# Altium schematic sheet f429ig.schdoc
size 431 x 309 mm; Symbol: Sheet-Symbol_A3; Device: Sheet-Symbol_A3; @Page Name: P1; @Create Date: 2023-08-19; @Page Count: 1; @Page No: 1; @Project Name: STM32F429IGT6_Moriarty; @Schematic Name: Schematic1_1; @Update Date: 2023-09-02; Company: 嘉立创EDA; Page Size: A3; Version: V1.0
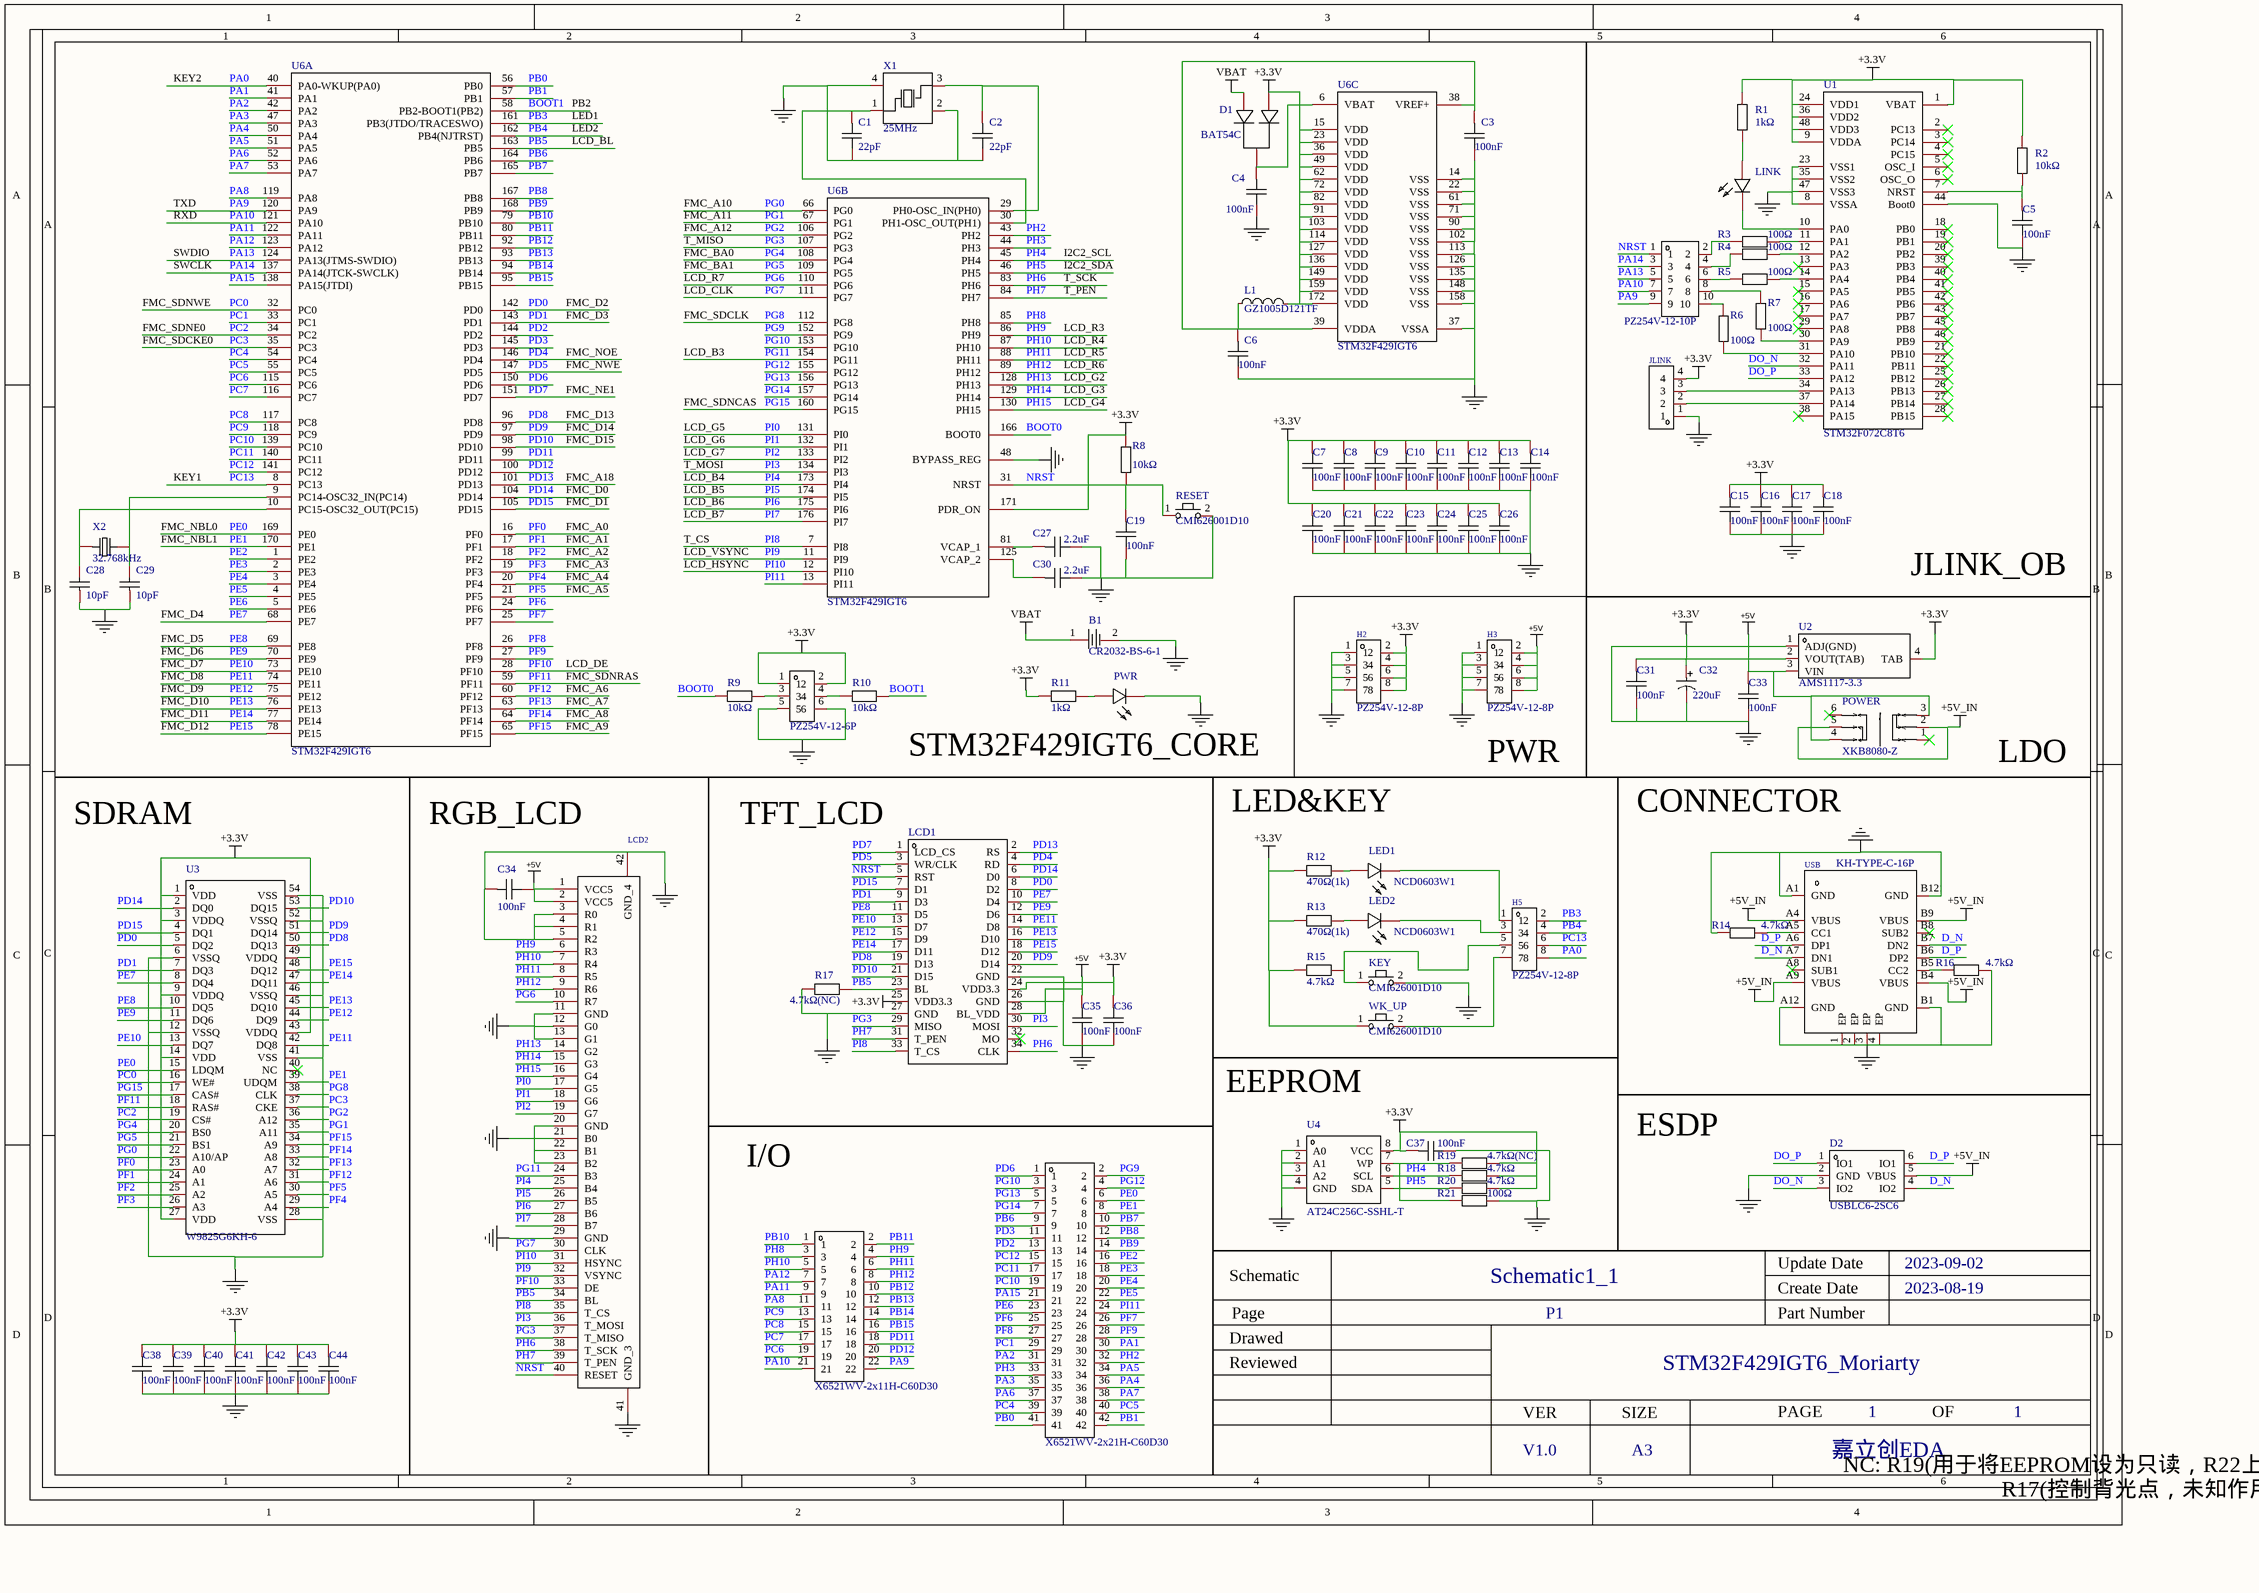
[diagram p0: f429ig.schdoc]

## Parts
B1  CR2032-BS-6-1  [BAT-TH_CR2032-BS-6-1]
C1  22pF  [C0603]
C2  22pF  [C0603]
C3  100nF  [C0603]
C4  100nF  [C0603]
C5  100nF  [C0603]
C6  100nF  [C0603]
C7  100nF  [C0603]
C8  100nF  [C0603]
C9  100nF  [C0603]
C10  100nF  [C0603]
C11  100nF  [C0603]
C12  100nF  [C0603]
C13  100nF  [C0603]
C14  100nF  [C0603]
C15  100nF  [C0603]
C16  100nF  [C0603]
C17  100nF  [C0603]
C18  100nF  [C0603]
C19  100nF  [C0603]
C20  100nF  [C0603]
C21  100nF  [C0603]
C22  100nF  [C0603]
C23  100nF  [C0603]
C24  100nF  [C0603]
C25  100nF  [C0603]
C26  100nF  [C0603]
C27  2.2uF  [C0603]
C28  10pF  [C0603]
C29  10pF  [C0603]
C30  2.2uF  [C0603]
C31  100nF  [C0603]
C32  220uF  [CAP-SMD_BD6.3-L6.6-W6.6-FD]
C33  100nF  [C0603]
C34  100nF  [C0603]
C35  100nF  [C0603]
C36  100nF  [C0603]
C37  100nF  [C0603]
C38  100nF  [C0603]
C39  100nF  [C0603]
C40  100nF  [C0603]
C41  100nF  [C0603]
C42  100nF  [C0603]
C43  100nF  [C0603]
C44  100nF  [C0603]
D1  BAT54C  [SOT-23-3_L2.9-W1.6-P1.90-LS2.8-BR]
D2  USBLC6-2SC6  [SOT-23-6_L2.9-W1.6-P0.95-LS2.8-BL]
H1  PZ254V-12-10P  [HDR-TH_10P-P2.54-V-M-R2-C5-S2.54]
H2  PZ254V-12-8P  [HDR-TH_8P-P2.54-V-M-R2-C4-S2.54]
H3  PZ254V-12-8P  [HDR-TH_8P-P2.54-V-M-R2-C4-S2.54]
H4  PZ254V-12-6P  [HDR-TH_6P-P2.54-V-M-R2-C3-S2.54]
H5  PZ254V-12-8P  [HDR-TH_8P-P2.54-V-M-R2-C4-S2.54]
H6  X6521WV-2x11H-C60D30  [HDR-TH_22P-2.54-V-M-R2-C11-S2.54]
JLINK  PZ254V-11-04P  [HDR-TH_4P-P2.54-V-M]  (value not drawn)
KEY  CMI626001D10  [SW-TH_2P-L6.2-W6.2-P5.0]
L1  GZ1005D121TF  [L0402]
LCD1  (no value)  [HDR-TH_34P-P2.54-V-F-R2-C17-S2.54]
LCD2  (no value)  [FPC-SMD_P0.50-40P_FGS-XJ-H2.0]
LED1  NCD0603W1  [LED0603-RD]
LED2  NCD0603W1  [LED0603-RD]
LINK  NCD0603W1  [LED0603-RD]  (value not drawn)
POWER  XKB8080-Z  [SW-TH_6P-L8.0-W8.0-P2.50]
PWR  NCD0603W1  [LED0603-RD]  (value not drawn)
R1  1kΩ  [R0603]
R2  10kΩ  [R0603]
R3  100Ω  [R0603]
R4  100Ω  [R0603]
R5  100Ω  [R0603]
R6  100Ω  [R0603]
R7  100Ω  [R0603]
R8  10kΩ  [R0603]
R9  10kΩ  [R0603]
R10  10kΩ  [R0603]
R11  1kΩ  [R0603]
R12  470Ω(1k)  [R0603]
R13  470Ω(1k)  [R0603]
R14  4.7kΩ  [R0603]
R15  4.7kΩ  [R0603]
R16  4.7kΩ  [R0603]
R17  4.7kΩ(NC)  [R0603]
R18  4.7kΩ  [R0603]
R19  4.7kΩ(NC)  [R0603]
R20  4.7kΩ  [R0603]
R21  100Ω  [R0603]
RESET  CMI626001D10  [SW-TH_2P-L6.2-W6.2-P5.0]
U1  STM32F072C8T6  [LQFP-48_L7.0-W7.0-P0.50-LS9.0-BL]
U2  AMS1117-3.3  [SOT-223-4_L6.5-W3.5-P2.30-LS7.0-BR]
U3  W9825G6KH-6  [TSOP-54_L22.2-W10.2-P0.80-LS11.8-BL]
U4  AT24C256C-SSHL-T  [SOIC-8_L4.9-W3.9-P1.27-LS6.0-BL]
U5  X6521WV-2x21H-C60D30  [HDR-TH_42P-P2.54-V-M-R2-C21-S2.54]
U6  STM32F429IGT6  [LQFP-176_L24.0-W24.0-P0.50-LS26.0-BL]  (parts A,B,C of 3)
USB  KH-TYPE-C-16P  [USB-C-SMD_KH-TYPE-C-16P]
WK_UP  CMI626001D10  [SW-TH_2P-L6.2-W6.2-P5.0]
X1  25MHz  [OSC-SMD_4P-L3.2-W2.5-BL]
X2  32.768kHz  [CRYSTAL-SMD_L3.2-W1.5-1]

## Blocks framed on the sheet
STM32F429IGT6_CORE: B1 C1-C4 C6-C14 C19-C30 D1 H4 L1 PWR R8-R11 RESET U6 X1 X2
JLINK_OB: C5 C15-C18 H1 JLINK LINK R1-R7 U1
PWR: H2 H3
SDRAM: C38-C44 U3
RGB_LCD: C34 LCD2
LED&KEY: H5 KEY LED1 LED2 R12 R13 R15 WK_UP
EEPROM: C37 R18-R21 U4
ESDP: D2
I/O: H6 U5

## Nets
+3.3V: C7.2 C8.2 C9.2 C10.2 C11.2 C12.2 C13.2 C14.2 C15.2 C16.2 C17.2 C18.2 C20.2 C21.2 C22.2 C23.2 C24.2 C25.2 C26.2 C31.2 C32.1 C36.2 C37.2 C38.2 C39.2 C40.2 C41.2 C42.2 C43.2 C44.2 D1.1(A1) H2.2 H2.4 H2.6 H2.8 H4.1 H4.2 JLINK.4 L1.2 LCD1.24(VDD3.3) LCD1.25(VDD3.3) R1.2 R2.2 R8.2 R11.2 R12.1 R13.1 R15.2 R18.1 R19.1 R20.1 U1.1(VBAT) U1.9(VDDA) U1.24(VDD1) U1.36(VDD2) U1.48(VDD3) U2.2(VOUT(TAB)) U2.4(TAB) U3.1(VDD) U3.3(VDDQ) U3.9(VDDQ) U3.14(VDD) U3.27(VDD) U3.43(VDDQ) U3.49(VDDQ) U4.8(VCC) U6.15(VDD) U6.23(VDD) U6.36(VDD) U6.49(VDD) U6.62(VDD) U6.72(VDD) U6.82(VDD) U6.91(VDD) U6.103(VDD) U6.114(VDD) U6.127(VDD) U6.136(VDD) U6.149(VDD) U6.159(VDD) U6.171(PDR_ON) U6.172(VDD) WK_UP.1
+5V: C33.2 C34.1 C35.2 H3.2 H3.4 H3.6 H3.8 LCD1.28(BL_VDD) LCD2.1(VCC5) LCD2.2(VCC5) POWER.3 POWER.4 U2.3(VIN)
+5V_IN: D2.5(VBUS) POWER.2 POWER.5 USB.A4(VBUS) USB.A9(VBUS) USB.B4(VBUS) USB.B9(VBUS)
NetB1_2: B1.2 C1.1 C2.1 C3.1 C4.1 C5.1 C6.1 C7.1 C8.1 C9.1 C10.1 C11.1 C12.1 C13.1 C14.1 C15.1 C16.1 C17.1 C18.1 C19.1 C20.1 C21.1 C22.1 C23.1 C24.1 C25.1 C26.1 C27.1 C28.1 C29.1 C30.1 C31.1 C32.2 C33.1 C34.2 C35.1 C36.1 C37.1 C38.1 C39.1 C40.1 C41.1 C42.1 C43.1 C44.1 D2.2(GND) H2.1 H2.3 H2.5 H2.7 H3.1 H3.3 H3.5 H3.7 H4.5 H4.6 JLINK.1 KEY.2 LCD1.22(GND) LCD1.26(GND) LCD1.27(GND) LCD2.3(R0) LCD2.4(R1) LCD2.5(R2) LCD2.11(GND) LCD2.12(G0) LCD2.13(G1) LCD2.20(GND) LCD2.21(B0) LCD2.22(B1) LCD2.23(B2) LCD2.29(GND) LCD2.41(GND_3) LCD2.42(GND_4) PWR.1(-) R14.2 R16.1 R17.2 R21.1 RESET.2 U1.8(VSSA) U1.23(VSS1) U1.35(VSS2) U1.44(Boot0) U1.47(VSS3) U2.1(ADJ(GND)) U3.6(VSSQ) U3.12(VSSQ) U3.28(VSS) U3.41(VSS) U3.46(VSSQ) U3.52(VSSQ) U3.54(VSS) U4.1(A0) U4.2(A1) U4.3(A2) U4.4(GND) U6.14(VSS) U6.22(VSS) U6.37(VSSA) U6.48(BYPASS_REG) U6.61(VSS) U6.71(VSS) U6.90(VSS) U6.102(VSS) U6.113(VSS) U6.126(VSS) U6.135(VSS) U6.148(VSS) U6.158(VSS) USB.1(EP) USB.2(EP) USB.3(EP) USB.4(EP) USB.A1(GND) USB.A12(GND) USB.B1(GND) USB.B12(GND) X1.2(GND) X1.4(GND)
VBAT: B1.1 D1.2(A2)
BOOT0: R9.2 U6.166(BOOT0)
BOOT1: R10.1 U6.58(PB2-BOOT1(PB2))
D_N: D2.4(IO2) USB.A7(DN1) USB.B7(DN2)
D_P: D2.6(IO1) USB.A6(DP1) USB.B6(DP2)
DO_N: D2.3(IO2) U1.32(PA11)
DO_P: D2.1(IO1) U1.33(PA12)
NRST: C19.2 H1.1 LCD1.5(RST) LCD2.40(RESET) R8.1 RESET.1 U6.31(NRST)
PA0: H5.8 U6.40(PA0-WKUP(PA0))
PA1: U5.30 U6.41(PA1)
PA2: U5.31 U6.42(PA2)
PA3: U5.35 U6.47(PA3)
PA4: U5.36 U6.50(PA4)
PA5: U5.34 U6.51(PA5)
PA6: U5.37 U6.52(PA6)
PA7: U5.38 U6.53(PA7)
PA8: H6.11 U6.119(PA8)
PA9: H1.9 H6.22 U6.120(PA9)
PA10: H1.7 H6.21 U6.121(PA10)
PA11: H6.9 U6.122(PA11)
PA12: H6.7 U6.123(PA12)
PA13: H1.5 U6.124(PA13(JTMS-SWDIO))
PA14: H1.3 U6.137(PA14(JTCK-SWCLK))
PA15: U5.21 U6.138(PA15(JTDI))
PB0: U5.41 U6.56(PB0)
PB1: U5.42 U6.57(PB1)
PB3: H5.2 U6.161(PB3(JTDO/TRACESWO))
PB4: H5.4 U6.162(PB4(NJTRST))
PB5: LCD1.23(BL) LCD2.34(BL) R17.1 U6.163(PB5)
PB6: U5.9 U6.164(PB6)
PB7: U5.10 U6.165(PB7)
PB8: U5.12 U6.167(PB8)
PB9: U5.14 U6.168(PB9)
PB10: H6.1 U6.79(PB10)
PB11: H6.2 U6.80(PB11)
PB12: H6.10 U6.92(PB12)
PB13: H6.12 U6.93(PB13)
PB14: H6.14 U6.94(PB14)
PB15: H6.16 U6.95(PB15)
PC0: U3.16(WE#) U6.32(PC0)
PC1: U5.29 U6.33(PC1)
PC2: U3.19(CS#) U6.34(PC2)
PC3: U3.37(CKE) U6.35(PC3)
PC4: U5.39 U6.54(PC4)
PC5: U5.40 U6.55(PC5)
PC6: H6.19 U6.115(PC6)
PC7: H6.17 U6.116(PC7)
PC8: H6.15 U6.117(PC8)
PC9: H6.13 U6.118(PC9)
PC10: U5.19 U6.139(PC10)
PC11: U5.17 U6.140(PC11)
PC12: U5.15 U6.141(PC12)
PC13: H5.6 U6.8(PC13)
PD0: LCD1.8(D2) U3.5(DQ2) U6.142(PD0)
PD1: LCD1.9(D3) U3.7(DQ3) U6.143(PD1)
PD2: U5.13 U6.144(PD2)
PD3: U5.11 U6.145(PD3)
PD4: LCD1.4(RD) U6.146(PD4)
PD5: LCD1.3(WR/CLK) U6.147(PD5)
PD6: U5.1 U6.150(PD6)
PD7: LCD1.1(LCD_CS) U6.151(PD7)
PD8: LCD1.19(D13) U3.50(DQ13) U6.96(PD8)
PD9: LCD1.20(D14) U3.51(DQ14) U6.97(PD9)
PD10: LCD1.21(D15) U3.53(DQ15) U6.98(PD10)
PD11: H6.18 U6.99(PD11)
PD12: H6.20 U6.100(PD12)
PD13: LCD1.2(RS) U6.101(PD13)
PD14: LCD1.6(D0) U3.2(DQ0) U6.104(PD14)
PD15: LCD1.7(D1) U3.4(DQ1) U6.105(PD15)
PE0: U3.15(LDQM) U5.6 U6.169(PE0)
PE1: U3.39(UDQM) U5.8 U6.170(PE1)
PE2: U5.16 U6.1(PE2)
PE3: U5.18 U6.2(PE3)
PE4: U5.20 U6.3(PE4)
PE5: U5.22 U6.4(PE5)
PE6: U5.23 U6.5(PE6)
PE7: LCD1.10(D4) U3.8(DQ4) U6.68(PE7)
PE8: LCD1.11(D5) U3.10(DQ5) U6.69(PE8)
PE9: LCD1.12(D6) U3.11(DQ6) U6.70(PE9)
PE10: LCD1.13(D7) U3.13(DQ7) U6.73(PE10)
PE11: LCD1.14(D8) U3.42(DQ8) U6.74(PE11)
PE12: LCD1.15(D9) U3.44(DQ9) U6.75(PE12)
PE13: LCD1.16(D10) U3.45(DQ10) U6.76(PE13)
PE14: LCD1.17(D11) U3.47(DQ11) U6.77(PE14)
PE15: LCD1.18(D12) U3.48(DQ12) U6.78(PE15)
PF0: U3.23(A0) U6.16(PF0)
PF1: U3.24(A1) U6.17(PF1)
PF2: U3.25(A2) U6.18(PF2)
PF3: U3.26(A3) U6.19(PF3)
PF4: U3.29(A4) U6.20(PF4)
PF5: U3.30(A5) U6.21(PF5)
PF6: U5.25 U6.24(PF6)
PF7: U5.26 U6.25(PF7)
PF8: U5.27 U6.26(PF8)
PF9: U5.28 U6.27(PF9)
PF10: LCD2.33(DE) U6.28(PF10)
PF11: U3.18(RAS#) U6.59(PF11)
PF12: U3.31(A6) U6.60(PF12)
PF13: U3.32(A7) U6.63(PF13)
PF14: U3.33(A8) U6.64(PF14)
PF15: U3.34(A9) U6.65(PF15)
PG0: U3.22(A10/AP) U6.66(PG0)
PG1: U3.35(A11) U6.67(PG1)
PG2: U3.36(A12) U6.106(PG2)
PG3: LCD1.29(MISO) LCD2.37(T_MISO) U6.107(PG3)
PG4: U3.20(BS0) U6.108(PG4)
PG5: U3.21(BS1) U6.109(PG5)
PG6: LCD2.10(R7) U6.110(PG6)
PG7: LCD2.30(CLK) U6.111(PG7)
PG8: U3.38(CLK) U6.112(PG8)
PG9: U5.2 U6.152(PG9)
PG10: U5.3 U6.153(PG10)
PG11: LCD2.24(B3) U6.154(PG11)
PG12: U5.4 U6.155(PG12)
PG13: U5.5 U6.156(PG13)
PG14: U5.7 U6.157(PG14)
PG15: U3.17(CAS#) U6.160(PG15)
PH2: U5.32 U6.43(PH2)
PH3: U5.33 U6.44(PH3)
PH4: R18.2 U4.6(SCL) U6.45(PH4)
PH5: R20.2 U4.5(SDA) U6.46(PH5)
PH6: LCD1.34(CLK) LCD2.38(T_SCK) U6.83(PH6)
PH7: LCD1.31(T_PEN) LCD2.39(T_PEN) U6.84(PH7)
PH8: H6.3 U6.85(PH8)
PH9: H6.4 LCD2.6(R3) U6.86(PH9)
PH10: H6.5 LCD2.7(R4) U6.87(PH10)
PH11: H6.6 LCD2.8(R5) U6.88(PH11)
PH12: H6.8 LCD2.9(R6) U6.89(PH12)
PH13: LCD2.14(G2) U6.128(PH13)
PH14: LCD2.15(G3) U6.129(PH14)
PH15: LCD2.16(G4) U6.130(PH15)
PI0: LCD2.17(G5) U6.131(PI0)
PI1: LCD2.18(G6) U6.132(PI1)
PI2: LCD2.19(G7) U6.133(PI2)
PI3: LCD1.30(MOSI) LCD2.36(T_MOSI) U6.134(PI3)
PI4: LCD2.25(B4) U6.173(PI4)
PI5: LCD2.26(B5) U6.174(PI5)
PI6: LCD2.27(B6) U6.175(PI6)
PI7: LCD2.28(B7) U6.176(PI7)
PI8: LCD1.33(T_CS) LCD2.35(T_CS) U6.7(PI8)
PI9: LCD2.32(VSYNC) U6.11(PI9)
PI10: LCD2.31(HSYNC) U6.12(PI10)
PI11: U5.24 U6.13(PI11)
NetC1_2: C1.2 U6.30(PH1-OSC_OUT(PH1)) X1.1(OSC1)
NetC2_2: C2.2 U6.29(PH0-OSC_IN(PH0)) X1.3(OSC2)
NetC3_2: C3.2 C6.2 L1.1 U6.38(VREF+) U6.39(VDDA)
NetC4_2: C4.2 D1.3(K) U6.6(VBAT)
NetC5_2: C5.2 R2.1 U1.7(NRST)
NetC27_2: C27.2 U6.81(VCAP_1)
NetC28_2: C28.2 U6.10(PC15-OSC32_OUT(PC15)) X2.1
NetC29_2: C29.2 U6.9(PC14-OSC32_IN(PC14)) X2.2
NetC30_2: C30.2 U6.125(VCAP_2)
NetH1_2: H1.2 R3.2
NetH1_4: H1.4 R4.2
NetH1_6: H1.6 R5.2
NetH1_8: H1.8 R7.1
NetH1_10: H1.10 R6.1
NetH4_3: H4.3 R9.1
NetH4_4: H4.4 R10.2
NetH5_1: H5.1 LED1.1(-)
NetH5_3: H5.3 LED2.1(-)
NetH5_5: H5.5 KEY.1 R15.1
NetH5_7: H5.7 WK_UP.2
NetJLINK_2: JLINK.2 U1.37(PA14)
NetJLINK_3: JLINK.3 U1.34(PA13)
NetLED1_2: LED1.2(+) R12.2
NetLED2_2: LED2.2(+) R13.2
NetLINK_1: LINK.1(-) U1.10(PA0)
NetLINK_2: LINK.2(+) R1.1
NetPWR_2: PWR.2(+) R11.1
NetR3_1: R3.1 U1.11(PA1)
NetR4_1: R4.1 U1.12(PA2)
NetR5_1: R5.1 U1.14(PA4)
NetR6_2: R6.2 U1.31(PA10)
NetR7_2: R7.2 U1.30(PA9)
NetR14_1: R14.1 USB.A5(CC1)
NetR16_2: R16.2 USB.B5(CC2)
NetR19_2: R19.2 R21.2 U4.7(WP)

Not connected (* = marked no-connect by the designer): LCD1 32(MO)*; POWER 1* 6*; U1 2(PC13)* 3(PC14)* 4(PC15)* 5(OSC_I)* 6(OSC_O)* 13(PA3)* 15(PA5)* 16(PA6)* 17(PA7)* 18(PB0)* 19(PB1)* 20(PB2)* 21(PB10)* 22(PB11)* 25(PB12)* 26(PB13)* 27(PB14)* 28(PB15)* 29(PA8)* 38(PA15)* 39(PB3)* 40(PB4)* 41(PB5)* 42(PB6)* 43(PB7)* 45(PB8)* 46(PB9)*; U3 40(NC)*; USB A8(SUB1)* B8(SUB2)*

## Notes on the sheet
- KEY2
- PB2
- LED1
- LED2
- LCD_BL
- TXD
- RXD
- FMC_A10
- FMC_A11
- FMC_A12
- FMC_SDNWE
- SWDIO
- SWCLK
- FMC_D2
- FMC_BA0
- FMC_BA1
- LCD_R7
- LCD_CLK
- T_MISO
- T_SCK
- T_PEN
- I2C2_SCL
- I2C2_SDA
- FMC_SDNE0
- FMC_SDCKE0
- FMC_D3
- FMC_NOE
- FMC_SDCLK
- LCD_B3
- LCD_R3
- LCD_R4
- LCD_R5
- FMC_D13
- FMC_D14
- FMC_NE1
- FMC_NWE
- FMC_SDNCAS
- LCD_G5
- LCD_G2
- (near R8) LCD_G4
- LCD_R6
- LCD_G3
- KEY1
- FMC_D15
- FMC_A18
- LCD_G7
- LCD_B4
- LCD_G6
- T_MOSI
- FMC_NBL0
- FMC_NBL1
- FMC_D0
- FMC_D1
- FMC_A0
- FMC_A1
- FMC_A2
- LCD_VSYNC
- LCD_B5
- LCD_B6
- LCD_B7
- T_CS
- FMC_A3
- FMC_A4
- FMC_A5
- LCD_HSYNC
- (near C29) FMC_D4
- FMC_D5
- FMC_D6
- FMC_D7
- FMC_D8
- FMC_SDNRAS
- LCD_DE
- FMC_D9
- FMC_D10
- FMC_D11
- FMC_D12
- FMC_A6
- FMC_A7
- FMC_A8
- FMC_A9
- LDO
- TFT_LCD
- CONNECTOR
- NC: R19(用于将EEPROM设为只读，R22上件，R23不上件时为只读)
  R17(控制背光点，未知作用，暂时不接)
- 1
- 2
- 3
- 4
- 5
- 6
- A
- B
- C
- Schematic
- Schematic1_1
- Create Date
- Update Date
- 2023-08-19
- 2023-09-02
- D
- Reviewed
- Drawed
- Page
- P1
- Part Number
- STM32F429IGT6_Moriarty
- VER
- SIZE
- PAGE
- OF
- V1.0
- A3
- 嘉立创EDA

## Library data of the parts
B1 = CR2032-BS-6-1: 连接器类型:电池底座;适用电池规格:CR2032;工作温度范围:-;; Manufacturer: QJ; Add into BOM: yes; Connector Type: 电池底座; Battery Type: CR2032; Name: CR2032-BS-6-1; Symbol: CR2032-BS-6-1; Device: CR2032-BS-6-1; LCSC Part Name: 电池底座 适用电池:CR2032; Supplier Part: C70377; Manufacturer Part: CR2032-BS-6-1; Supplier Footprint: SMD; JLCPCB Part Class: 扩展库; Datasheet: https://atta.szlcsc.com/upload/public/pdf/source/20160427/1461725216549.pdf; Supplier: LCSC; Convert to PCB: yes; Operating Temperature Range: -
C1 C2 = 0603CG220J500NT: 温度系数:C0G;精度:±5%;额定电压:50V;容值:22pF;; Manufacturer: FH(风华); Add into BOM: yes; Temperature Coefficient: C0G; Tolerance: ±5%; Voltage Rated: 50V; Name: 22pF; Symbol: 0603CG220J500NT; Device: 0603CG220J500NT; LCSC Part Name: 22pF(220) ±5% 50V; Supplier Part: C91701; Manufacturer Part: 0603CG220J500NT; Supplier Footprint: 0603; JLCPCB Part Class: Extended Part; Datasheet: https://atta.szlcsc.com/upload/public/pdf/source/20170923/C91701_1506149567492988977.pdf; Supplier: LCSC; Convert to PCB: yes; Value: 22pF
C3 C6 = CAP_0603: Symbol: CapAcitance; Convert to PCB: yes; Name: 100nF; Device: CAP_0603; Add into BOM: yes; Supplier Footprint: 0603; Value: 100nF
C4 C5 C7-C26 C31 C33-C44 = CC0603KRX7R9BB104: 容值:100nF;精度:±10%;额定电压:50V;材质(温度系数):X7R;; Manufacturer: YAGEO(国巨); Add into BOM: yes; Tolerance: ±10%; Voltage Rated: 50V; Temperature Coefficient: X7R; Name: 100nF; Symbol: CC0603KRX7R9BB104; Device: CC0603KRX7R9BB104; LCSC Part Name: 100nF ±10% 50V; Supplier Part: C14663; Manufacturer Part: CC0603KRX7R9BB104; Supplier Footprint: 0603; JLCPCB Part Class: Basic Part; Datasheet: https://atta.szlcsc.com/upload/public/pdf/source/20180910/C282072_33301C7F631E79921B82A8DAC6BCC5B3.pdf; Supplier: LCSC; Convert to PCB: yes; Value: 100nF
C27 C30 = CL10A225KQ8NNNC: 容值:2.2uF;精度:±10%;额定电压:6.3V;材质(温度系数):X5R;; Manufacturer: SAMSUNG(三星); Add into BOM: yes; Tolerance: ±10%; Voltage Rated: 6.3V; Temperature Coefficient: X5R; Name: 2.2uF; Symbol: CL10A225KQ8NNNC; Device: CL10A225KQ8NNNC; LCSC Part Name: 2.2uF ±10% 6.3V; Supplier Part: C71000; Manufacturer Part: CL10A225KQ8NNNC; Supplier Footprint: 0603; JLCPCB Part Class: Extended Part; Datasheet: https://atta.szlcsc.com/upload/public/pdf/source/20180326/C71000_DC8419B77556AD3ECA55C764A060977E.pdf; Supplier: LCSC; Convert to PCB: yes; Value: 2.2uF
C28 C29 = CC0603JRNPO9BN100: 容值:10pF;精度:±5%;额定电压:50V;材质(温度系数):NP0;; Manufacturer: YAGEO(国巨); Add into BOM: yes; Tolerance: ±5%; Voltage Rated: 50V; Temperature Coefficient: NP0; Name: 10pF; Symbol: CC0603JRNPO9BN100; Device: CC0603JRNPO9BN100; LCSC Part Name: 10pF ±5% 50V; Supplier Part: C106245; Manufacturer Part: CC0603JRNPO9BN100; Supplier Footprint: 0603; JLCPCB Part Class: 扩展库; Datasheet: https://atta.szlcsc.com/upload/public/pdf/source/20170505/1493957837406.pdf; Supplier: LCSC; Convert to PCB: yes; Value: 10pF
C32 = RVT1A221M0605_C72494: 容值:220uF;精度:±20%;额定电压:10V;纹波电流:-;等效串联电阻:-;; Manufacturer: ROQANG(容强); Symbol: RVT1A221M0605-C72494; Add into BOM: yes; Tolerance: ±20%; Rated Voltage: 10V; φD: 6.3mm; L: 5.4mm; Lifetime @ Temp: 2000hrs@105℃; Name: 220uF; Device: RVT1A221M0605_C72494; LCSC Part Name: 220uF ±20% 10V; Supplier Part: C72494; Manufacturer Part: RVT1A221M0605; Supplier Footprint: SMD,D6.3xL5.4mm; JLCPCB Part Class: 扩展库; Datasheet: https://atta.szlcsc.com/upload/public/pdf/source/20170217/1487312287485.pdf; Supplier: LCSC; Convert to PCB: yes; Value: 220uF; Ripple Current: -; Equivalent Series Resistance(ESR): -; Operating Temperature: -45℃~+105℃
D1 = BAT54C_C2135: 二极管配置:-;直流反向耐压(Vr):30V;平均整流电流(Io):200mA;正向压降(Vf):1V@100mA;; Manufacturer: CJ(江苏长电/长晶); Add into BOM: yes; Reverse Voltage (Vr): 30V; Average Rectified Current (Io): 200mA; Name: BAT54C; Symbol: BAT54C; Device: BAT54C_C2135; LCSC Part Name: 30V 200mA 1V@100mA; Supplier Part: C2135; Manufacturer Part: BAT54C; Supplier Footprint: SOT-23; JLCPCB Part Class: 扩展库; Datasheet: https://atta.szlcsc.com/upload/public/pdf/source/20140809/1457707208935.pdf; Supplier: LCSC; Convert to PCB: yes; Diode Configuration: -; Forward Voltage (Vf@If): 1V@100mA; Reverse Leakage Current (Ir): -
D2 = USBLC6-2SC6_C2827654: USBLC6-2SC6 Vrwm:5V 印记：UL26  ESD静电管静电放电(ESD)保护器件; Manufacturer: TECH PUBLIC(台舟); Add into BOM: yes; Name: USBLC6-2SC6; Symbol: USBLC6-2SC6_C2827654; Device: USBLC6-2SC6_C2827654; LCSC Part Name: USBLC6-2SC6; Supplier Part: C2827654; Manufacturer Part: USBLC6-2SC6; Supplier Footprint: SOT-23-6; JLCPCB Part Class: Extended Part; Datasheet: https://atta.szlcsc.com/upload/public/pdf/source/20210810/FBD75DE717D6D97BAC6DD7F2B5C09DCD.pdf; Supplier: LCSC; Convert to PCB: yes
H1 = PZ254V-12-10P: 排数:双排;总PIN位数:10;间距:2.54mm;插针结构:2x5P;行距:2.54mm;安装类型:直插;圆针/方针:方针;额定电流:-;额定电压:-;配合针长度:6mm;塑高:2.5mm;端接针长度:3mm;触头材质:黄铜;触头镀层:-;工作温度范围:-40℃~+105℃;颜色:黑色;; Manufacturer: XFCN(兴飞); Add into BOM: yes; Pitch: 2.54mm; Pin Structure: 2x5P; Circluar Pins/Square Pins: 方针; Name: PZ254V-12-10P; Symbol: PZ254V-12-10P; Device: PZ254V-12-10P; LCSC Part Name: 2.54mm 2x5P 直插 方针; Supplier Part: C492422; Manufacturer Part: PZ254V-12-10P; Supplier Footprint: 直插,P=2.54mm; JLCPCB Part Class: 扩展库; Supplier: LCSC; Convert to PCB: yes; Number of Rows: 双排; Number of Pins: 10; Row Spacing: 2.54mm; Mounting Type: 直插; Current Rating (Max): -; Voltage Rating (Max): -; Length of Mating Pin: 6mm; Insulation Height: 2.5mm; Length of End Connection Pin: 3mm; Contact Material: 黄铜; Contact Plating: -; Operating Temperature Range: -40℃~+105℃; Color: 黑色
H2 H3 H5 = PZ254V-12-8P: 排数:双排;总PIN位数:8P;间距:2.54mm;插针结构:2x4P;行距:2.54mm;安装类型:直插;圆针/方针:方针;额定电流:-;额定电压:-;配合针长度:6mm;塑高:2.5mm;端接针长度:3mm;触头材质:黄铜;触头镀层:-;工作温度范围:-40℃~+105℃;颜色:黑色;; Manufacturer: XFCN(兴飞); Add into BOM: yes; Pitch: 2.54mm; Pin Structure: 2x4P; Circluar Pins/Square Pins: 方针; Name: PZ254V-12-8P; Symbol: PZ254V-12-8P; Device: PZ254V-12-8P; LCSC Part Name: 2.54mm 2x4P 直插 方针; Supplier Part: C492421; Manufacturer Part: PZ254V-12-8P; Supplier Footprint: 插件,P=2.54mm; JLCPCB Part Class: 扩展库; Datasheet: https://atta.szlcsc.com/upload/public/pdf/source/20200309/C492421_DC8A206AF99CD7755BD4A5B0BC48200B.pdf; Supplier: LCSC; Convert to PCB: yes; Number of Rows: 双排; Number of Pins: 8P; Row Spacing: 2.54mm; Mounting Type: 直插; Current Rating (Max): -; Voltage Rating (Max): -; Length of Mating Pin: 6mm; Insulation Height: 2.5mm; Length of End Connection Pin: 3mm; Contact Material: 黄铜; Contact Plating: -; Operating Temperature Range: -40℃~+105℃; Color: 黑色
H4 = PZ254V-12-6P: 排数:双排;总PIN位数:6P;间距:2.54mm;插针结构:2x3P;行距:2.54mm;安装类型:直插;圆针/方针:方针;额定电流:-;额定电压:-;配合针长度:6mm;塑高:2.5mm;端接针长度:3mm;触头材质:黄铜;触头镀层:-;工作温度范围:-40℃~+105℃;颜色:黑色;; Manufacturer: XFCN(兴飞); Add into BOM: yes; Pitch: 2.54mm; Pin Structure: 2x3P; Circluar Pins/Square Pins: 方针; Name: PZ254V-12-6P; Symbol: PZ254V-12-6P; Device: PZ254V-12-6P; LCSC Part Name: 2.54mm 2x3P 直插 方针; Supplier Part: C492420; Manufacturer Part: PZ254V-12-6P; Supplier Footprint: 插件,P=2.54mm; JLCPCB Part Class: Extended Part; Datasheet: https://atta.szlcsc.com/upload/public/pdf/source/20200309/C492420_BAECB307B001054C09D200388220EAE6.pdf; Supplier: LCSC; Convert to PCB: yes; Number of Rows: 双排; Number of Pins: 6P; Row Spacing: 2.54mm; Mounting Type: 直插; Current Rating (Max): -; Voltage Rating (Max): -; Length of Mating Pin: 6mm; Insulation Height: 2.5mm; Length of End Connection Pin: 3mm; Contact Material: 黄铜; Contact Plating: -; Operating Temperature Range: -40℃~+105℃; Color: 黑色
H6 = X6521WV-2x11H-C60D30: 排数:双排;总PIN位数:22P;间距:2.54mm;插针结构:2x11P;行距:2.54mm;安装类型:直插;圆针/方针:方针;额定电流:3A;额定电压:250V;配合针长度:6mm;塑高:2.5mm;端接针长度:3mm;触头材质:黄铜;触头镀层:金;工作温度范围:-40℃~+105℃;焊接温度(最大值):260℃;颜色:黑色;; Manufacturer: XKB Connectivity(中国星坤); Symbol: X6521WV-2×11H-C30D60; Add into BOM: yes; Pitch: 2.54mm; Pin Structure: 2x11P; Circluar Pins/Square Pins: 方针; Current Rating (Max): 3A; Voltage Rating (Max): 250V; Welding Temperature (Max): 260℃; Name: X6521WV-2x11H-C60D30; Device: X6521WV-2x11H-C60D30; LCSC Part Name: 间距:2.54mm 2x11P 直插 方针 高镀金 抗氧化; Supplier Part: C725883; Manufacturer Part: X6521WV-2x11H-C60D30; Supplier Footprint: 插件,P=2.54mm; JLCPCB Part Class: 扩展库; Supplier: LCSC; Convert to PCB: yes; Number of Rows: 双排; Number of Pins: 22P; Row Spacing: 2.54mm; Mounting Type: 直插; Length of Mating Pin: 6mm; Insulation Height: 2.5mm; Length of End Connection Pin: 3mm; Contact Material: 黄铜; Contact Plating: 金; Operating Temperature Range: -40℃~+105℃; Color: 黑色
JLINK = PZ254V-11-04P: 排数:单排;总PIN位数:4P;间距:2.54mm;插针结构:1x4P;行距:-;安装类型:直插;圆针/方针:方针;额定电流:3A;额定电压:250V;配合针长度:6mm;塑高:2.5mm;端接针长度:3mm;触头材质:-;工作温度范围:-40℃~+105℃;颜色:黑色;; Manufacturer: XFCN(兴飞); Symbol: PZ254V-11-04P_C2691448; Add into BOM: yes; Pitch: 2.54mm; Pin Structure: 1x4P; Circluar Pins/Square Pins: 方针; Current Rating (Max): 3A; Voltage Rating (Max): 250V; Name: PZ254V-11-04P; Device: PZ254V-11-04P; LCSC Part Name: 2.54mm 1x4P 直插 方针; Supplier Part: C2691448; Manufacturer Part: PZ254V-11-04P; Supplier Footprint: 插件,P=2.54mm; JLCPCB Part Class: Extended Part; Datasheet: https://atta.szlcsc.com/upload/public/pdf/source/20200309/C492403_F9F19131791D08044AD4F84F8E751A34.pdf; Supplier: LCSC; Convert to PCB: yes; Number of Rows: 单排; Number of Pins: 4P; Row Spacing: -; Mounting Type: 直插; Length of Mating Pin: 6mm; Insulation Height: 2.5mm; Length of End Connection Pin: 3mm; Contact Material: -; Operating Temperature Range: -40℃~+105℃; Color: 黑色
KEY RESET WK_UP = CMI626001D10: Manufacturer: Kailh(凯华); Add into BOM: yes; Name: CMI626001D10; Symbol: CMI626001D10; Device: CMI626001D10; LCSC Part Name: CMI626001D10; Supplier Part: C400266; Manufacturer Part: CMI626001D10; Supplier Footprint: 插件; JLCPCB Part Class: 扩展库; Datasheet: https://atta.szlcsc.com/upload/public/pdf/source/20190626/C400266_F09CE2215BA191CEE71F298860C4E0AB.pdf; Supplier: LCSC; Convert to PCB: yes
L1 = GZ1005D121TF: 标称阻抗@测试频率:120Ω@100MHz;误差:±25%;直流电阻(RDC):400mΩ;; Manufacturer: Sunlord(顺络); Add into BOM: yes; Tolerance: ±25%; DC Resistance: 400mΩ; Current Rating: 200mA; Circuits: 1; Name: GZ1005D121TF; Symbol: GZ1005D121TF; Device: GZ1005D121TF; LCSC Part Name: 单路 0402磁珠 阻抗120Ω@100MHz; Supplier Part: C38480; Manufacturer Part: GZ1005D121TF; Supplier Footprint: 0402; JLCPCB Part Class: Extended Part; Datasheet: https://atta.szlcsc.com/upload/public/pdf/source/20210830/355EA7C0FAC5394FC0FE3F17C770C20A.pdf; Supplier: LCSC; Convert to PCB: yes; Impedance @ Frequency: 120Ω@100MHz
LCD1 = PM2.54-2*17: Name: =Manufacturer Part; Symbol: PM2.54-2*17; Device: PM2.54-2*17
LCD2 = AFC01-S40FCA-00: Name: =Manufacturer Part; Symbol: AFC01-S40FCA-00; Device: AFC01-S40FCA-00
LED1 LED2 LINK PWR = NCD0603W1: 发光颜色:白灯;; Manufacturer: 国星光电; Symbol: FC-D1608WD-460H5; Add into BOM: yes; Emitted Color: 白灯; Name: NCD0603W1; Device: NCD0603W1; LCSC Part Name: NCD0603W1; Supplier Part: C84265; Manufacturer Part: NCD0603W1; Supplier Footprint: 0603; JLCPCB Part Class: Extended Part; Datasheet: https://atta.szlcsc.com/upload/public/pdf/source/20200820/C84265_479E6193713348A548E5CD6D9278BF16.pdf; Supplier: LCSC; Convert to PCB: yes
POWER = XKB8080-Z: 触点电流:100mA;额定电压 (AC):250V;额定电压 (DC):30V;绝缘电阻:100MΩ;安装方式:直插;自锁/无锁:自锁;按键形状:矩形按钮;按键/盖帽颜色:蓝色;带灯:无;引脚样式:PC引脚;作用力:160gf@±80gf;防护等级:-;工作温度:-15℃~+55℃;机械寿命:100000;; Manufacturer: XKB Connectivity(中国星坤); Add into BOM: yes; Contact Current: 100mA; Voltage Rating (AC): 250V; Voltage Rating (DC): 30V; Insulation Resistance: 100MΩ; Self Lock / No Lock: 自锁; Actuator Style: 矩形按钮; Actuator/Cap Color: 蓝色; With Lamp: 无; Pin Style: PC引脚; Mechanical Life: 100000; Name: XKB8080-Z; Symbol: XKB8080-Z; Device: XKB8080-Z; LCSC Part Name: 8*8 蓝白黑 自锁开关; Supplier Part: C318860; Manufacturer Part: XKB8080-Z; Supplier Footprint: 插件; JLCPCB Part Class: 扩展库; Datasheet: https://atta.szlcsc.com/upload/public/pdf/source/20200227/C318860_5054FF4F05FC2BEF6D52FB06C07EBD2C.pdf; Supplier: LCSC; Convert to PCB: yes; Mounting Style: 直插; Operating Force: 160gf@±80gf; IP Rating: -; Operating Temperature: -15℃~+55℃
R1 R11 = 0603WAF1001T5E: 电阻类型:厚膜电阻;阻值:1kΩ;精度:±1%;功率:100mW;; Manufacturer: UNI-ROYAL(厚声); Add into BOM: yes; Tolerance: ±1%; Power(Watts): 100mW; Temperature Coefficient: ±100ppm/℃; Overload Voltage (Max): 75V; Name: 1kΩ; Symbol: 0603WAF1001T5E; Device: 0603WAF1001T5E; LCSC Part Name: 1kΩ ±1% 100mW; Supplier Part: C21190; Manufacturer Part: 0603WAF1001T5E; Supplier Footprint: 0603; JLCPCB Part Class: Basic Part; Datasheet: https://atta.szlcsc.com/upload/public/pdf/source/20200306/C422600_1E6D84923E4A46A82E41ADD87F860B5C.pdf; Supplier: LCSC; Convert to PCB: yes; Type: 厚膜电阻; Value: 1kΩ; Operating Temperature Range: -55℃~+155℃
R2 R8-R10 = 0603WAF1002T5E: 电阻类型:厚膜电阻;阻值:10kΩ;精度:±1%;功率:100mW;; Manufacturer: UNI-ROYAL(厚声); Symbol: 0603WAF4701T5E; Add into BOM: yes; Tolerance: ±1%; Power(Watts): 100mW; Temperature Coefficient: ±100ppm/℃; Overload Voltage (Max): 75V; Name: 10kΩ; Device: 0603WAF1002T5E; LCSC Part Name: 厚膜电阻 10kΩ ±1% 100mW; Supplier Part: C25804; Manufacturer Part: 0603WAF1002T5E; Supplier Footprint: 0603; JLCPCB Part Class: Basic Part; Datasheet: https://atta.szlcsc.com/upload/public/pdf/source/20200306/C422600_1E6D84923E4A46A82E41ADD87F860B5C.pdf; Supplier: LCSC; Convert to PCB: yes; Type: 厚膜电阻; Value: 10kΩ; Operating Temperature Range: -55℃~+155℃
R3-R7 R21 = 0603WAF1000T5E: 电阻类型:厚膜电阻;阻值:100Ω;精度:±1%;功率:100mW;; Manufacturer: UNI-ROYAL(厚声); Add into BOM: yes; Tolerance: ±1%; Power(Watts): 100mW; Temperature Coefficient: ±200ppm/℃; Overload Voltage (Max): 75V; Name: 100Ω; Symbol: 0603WAF1000T5E; Device: 0603WAF1000T5E; LCSC Part Name: 100Ω ±1% 100mW; Supplier Part: C22775; Manufacturer Part: 0603WAF1000T5E; Supplier Footprint: 0603; JLCPCB Part Class: Basic Part; Datasheet: https://atta.szlcsc.com/upload/public/pdf/source/20200306/C422600_1E6D84923E4A46A82E41ADD87F860B5C.pdf; Supplier: LCSC; Convert to PCB: yes; Type: 厚膜电阻; Value: 100Ω; Operating Temperature Range: -55℃~+155℃
R12 R13 = 0603WAF4700T5E: 电阻类型:厚膜电阻;阻值:470Ω;精度:±1%;功率:100mW;; Manufacturer: UNI-ROYAL(厚声); Add into BOM: yes; Tolerance: ±1%; Power(Watts): 100mW; Temperature Coefficient: ±100ppm/℃; Overload Voltage (Max): 75V; Name: 470Ω(1k); Symbol: 0603WAF4700T5E; Device: 0603WAF4700T5E; LCSC Part Name: 470Ω ±1% 100mW; Supplier Part: C23179; Manufacturer Part: 0603WAF4700T5E; Supplier Footprint: 0603; JLCPCB Part Class: 基础库; Datasheet: https://atta.szlcsc.com/upload/public/pdf/source/20200306/C422600_1E6D84923E4A46A82E41ADD87F860B5C.pdf; Supplier: LCSC; Convert to PCB: yes; Type: 厚膜电阻; Value: 470Ω(1k); Operating Temperature Range: -55℃~+155℃
R14-R20 = 0603WAF4701T5E: 电阻类型:厚膜电阻;阻值:4.7kΩ;精度:±1%;功率:100mW;; Manufacturer: UNI-ROYAL(厚声); Add into BOM: yes; Tolerance: ±1%; Power(Watts): 100mW; Temperature Coefficient: ±100ppm/℃; Overload Voltage (Max): 75V; Symbol: 0603WAF4701T5E; Device: 0603WAF4701T5E; LCSC Part Name: 4.7kΩ ±1% 100mW; Supplier Part: C23162; Manufacturer Part: 0603WAF4701T5E; Supplier Footprint: 0603; JLCPCB Part Class: Basic Part; Datasheet: https://atta.szlcsc.com/upload/public/pdf/source/20200306/C422600_1E6D84923E4A46A82E41ADD87F860B5C.pdf; Supplier: LCSC; Convert to PCB: yes; Type: 厚膜电阻; Operating Temperature Range: -55℃~+155℃
  R14-R16 R18 R20: Name: 4.7kΩ; Value: 4.7kΩ
  R17 R19: Name: 4.7kΩ(NC); Value: 4.7kΩ(NC)
U1 = STM32F072C8T6: Manufacturer: ST(意法半导体); Add into BOM: yes; Name: STM32F072C8T6; Symbol: STM32F072C8T6; Device: STM32F072C8T6; LCSC Part Name: STM32F072C8T6; Supplier Part: C80488; Manufacturer Part: STM32F072C8T6; Supplier Footprint: LQFP-48(7x7); JLCPCB Part Class: Extended Part; Datasheet: https://atta.szlcsc.com/upload/public/pdf/source/20160816/1471343013459.pdf; Supplier: LCSC; Convert to PCB: yes
U2 = AMS1117-3.3_C347222: 输出类型:固定;输出极性:正;最大输入电压:18V;输出电压:3.3V;输出电流:1A;电源纹波抑制比(PSRR):60dB@(120Hz);; Manufacturer: UMW(广东友台半导体); Add into BOM: yes; Output Type: 固定; Output Polarity: 正; Number of Outputs: 1; Maximum Input Voltage: 18V; Output Voltage: 3.3V; Dropout Voltage: 1.3V@(1A); Output Current: 1A; Name: AMS1117-3.3; Symbol: AMS1117-3.3_C347222; Device: AMS1117-3.3_C347222; LCSC Part Name: AMS1117-3.3; Supplier Part: C347222; Manufacturer Part: AMS1117-3.3; Supplier Footprint: SOT-223; JLCPCB Part Class: Extended Part; Datasheet: https://atta.szlcsc.com/upload/public/pdf/source/20211011/50CC665C22E3A66C08379A4A74BDA25C.pdf; Supplier: LCSC; Convert to PCB: yes; Power Supply Rejection Ratio (PSRR): 60dB@(120Hz)
U3 = W9825G6KH-6: Manufacturer: WINBOND(华邦); Add into BOM: yes; Name: W9825G6KH-6; Symbol: W9825G6KH-6; Device: W9825G6KH-6; LCSC Part Name: W9825G6KH-6; Supplier Part: C62246; Manufacturer Part: W9825G6KH-6; Supplier Footprint: TSOP-54-10.2mm; JLCPCB Part Class: Extended Part; Datasheet: https://atta.szlcsc.com/upload/public/pdf/source/20170322/1490151652935.pdf; Supplier: LCSC; Convert to PCB: yes
U4 = AT24C256C-SSHL-T: The Microchip AT24C256C is a 256Kb Serial EEPROM utilizing an I2C (2-wire) serial interface. The device is organized as one block of 32K x 8 and is optimized for use in consumer, industrial, and automotive applications where reliable and dependable nonvol; Manufacturer: MICROCHIP(美国微芯); Add into BOM: yes; Name: AT24C256C-SSHL-T; Symbol: AT24C256C-SSHL-T; Device: AT24C256C-SSHL-T; LCSC Part Name: AT24C256C-SSHL-T; Supplier Part: C6482; Manufacturer Part: AT24C256C-SSHL-T; Supplier Footprint: SOIC-8-150mil; JLCPCB Part Class: 基础库; Datasheet: https://atta.szlcsc.com/upload/public/pdf/source/20140724/1457707164965.pdf; Supplier: LCSC; Convert to PCB: yes
U5 = X6521WV-2x21H-C60D30: 排数:双排;总PIN位数:42P;间距:2.54mm;插针结构:2x21P;行距:2.54mm;安装类型:直插;圆针/方针:方针;额定电流:3A;额定电压:250V;配合针长度:6mm;塑高:2.5mm;端接针长度:3mm;触头材质:黄铜;触头镀层:金;工作温度范围:-40℃~+105℃;焊接温度(最大值):260℃;颜色:黑色;; Manufacturer: XKB Connectivity(中国星坤); Symbol: X6521WV-2X21H-C30D60; Add into BOM: yes; Pitch: 2.54mm; Pin Structure: 2x21P; Circluar Pins/Square Pins: 方针; Current Rating (Max): 3A; Voltage Rating (Max): 250V; Welding Temperature (Max): 260℃; Name: X6521WV-2x21H-C60D30; Device: X6521WV-2x21H-C60D30; LCSC Part Name: 间距:2.54mm 2x21P 直插 方针; Supplier Part: C2883963; Manufacturer Part: X6521WV-2x21H-C60D30; Supplier Footprint: 插件,P=2.54mm; JLCPCB Part Class: 扩展库; Supplier: LCSC; Convert to PCB: yes; Number of Rows: 双排; Number of Pins: 42P; Row Spacing: 2.54mm; Mounting Type: 直插; Length of Mating Pin: 6mm; Insulation Height: 2.5mm; Length of End Connection Pin: 3mm; Contact Material: 黄铜; Contact Plating: 金; Operating Temperature Range: -40℃~+105℃; Color: 黑色
U6 = STM32F429IGT6: CPU内核:ARM Cortex-M4;CPU最大主频:180MHz;程序存储容量:1MB;程序存储器类型:FLASH;RAM总容量:256KB;GPIO端口数量:140;; Manufacturer: ST(意法半导体); Add into BOM: yes; CPU Maximum Speed: 180MHz; Operating Voltage Range: 1.8V~3.6V; Program Storage Size: 1MB; Program Memory Type: FLASH; RAM Size: 256KB; GPIO Ports Number: 140; ADC (Bit): 12bit; Universal Serial Bus: 有; Peripheral/Function: DMA；LCD/LED驱动；PWM; Name: STM32F429IGT6; Symbol: STM32F429IGT6; Device: STM32F429IGT6; LCSC Part Name: ARM Cortex-M4 180MHz; Supplier Part: C54328; Manufacturer Part: STM32F429IGT6; Supplier Footprint: LQFP-176(24x24); JLCPCB Part Class: Extended Part; Datasheet: https://atta.szlcsc.com/upload/public/pdf/source/20170102/1483323670635.pdf; Supplier: LCSC; Convert to PCB: yes; CPU Core: ARM Cortex-M4; EEPROM: -; DAC (Bit): 12bit; PWM (Bit): -; Internal Comparator: -; communication protocol: -; Watchdog: 有; Real-Time Clock: -; Infrared Data Association: 有; Low-Voltage Detect: 有; CCP Capture/Compare: -; LCD Module: 有; Secure Digital Input and Output: -; Direct Memory Access: 有; Internal Oscillator: 有; Operating Temperature Range: -40℃~+85℃
USB = KH-TYPE-C-16P: Type-C母座 16PIN 立式四角贴板无压片; Manufacturer: kinghelm(金航标); Add into BOM: yes; Name: KH-TYPE-C-16P; Symbol: KH-TYPE-C-16P; Device: KH-TYPE-C-16P; LCSC Part Name: Type-C母座; Supplier Part: C709357; Manufacturer Part: KH-TYPE-C-16P; Supplier Footprint: -; JLCPCB Part Class: Extended Part; Supplier: LCSC; Convert to PCB: yes
X1 = X322525MOB4SI: 频率:25MHz;频率公差:±10ppm;负载电容:12pF;; Manufacturer: YXC(扬兴晶振); Add into BOM: yes; Crystal Type: 贴片无源晶振; Frequency Tolerance: ±10ppm; Frequency Stability: ±30ppm; Load Capacitance: 12pF; Name: 25MHz; Symbol: X322525MOB4SI; Device: X322525MOB4SI; LCSC Part Name: 25MHz ±10ppm 12pF YSX321SL; Supplier Part: C9006; Manufacturer Part: X322525MOB4SI; Supplier Footprint: SMD3225-4P; JLCPCB Part Class: Basic Part; Datasheet: https://atta.szlcsc.com/upload/public/pdf/source/20210329/C112971_1F611BDC486E193C1706F6D8EB5AA189.pdf; Supplier: LCSC; Convert to PCB: yes; Value: 25MHz; Operating Temperature: -40℃~+85℃
X2 = Q13FC1350004900: 频率:32.768kHz;频率公差:±20ppm;负载电容:6pF;; Manufacturer: EPSON(爱普生); Add into BOM: yes; Crystal Type: 贴片无源晶振; Frequency Tolerance: ±20ppm; Load Capacitance: 6pF; Equivalent Series Resistance (ESR): 70kΩ; Name: 32.768kHz; Symbol: Q13FC1350004900; Device: Q13FC1350004900; LCSC Part Name: 32.768kHz ±20ppm 6pF; Supplier Part: C95361; Manufacturer Part: Q13FC1350004900; Supplier Footprint: SMD3215-2P; JLCPCB Part Class: 扩展库; Datasheet: https://atta.szlcsc.com/upload/public/pdf/source/20230307/B34DAB909D91A4E9CF7EB9FB947CF9CB.pdf; Supplier: LCSC; Convert to PCB: yes; Value: 32.768kHz; Operating Temperature: -40℃~+85℃